# Altium schematic sheet lelay.SchDoc
size A3; Organization: Altium Limited; Address1: L3, 12a Rodborough Rd; Address2: Frenchs Forest; Address3: NSW; Address4: Australia 2086
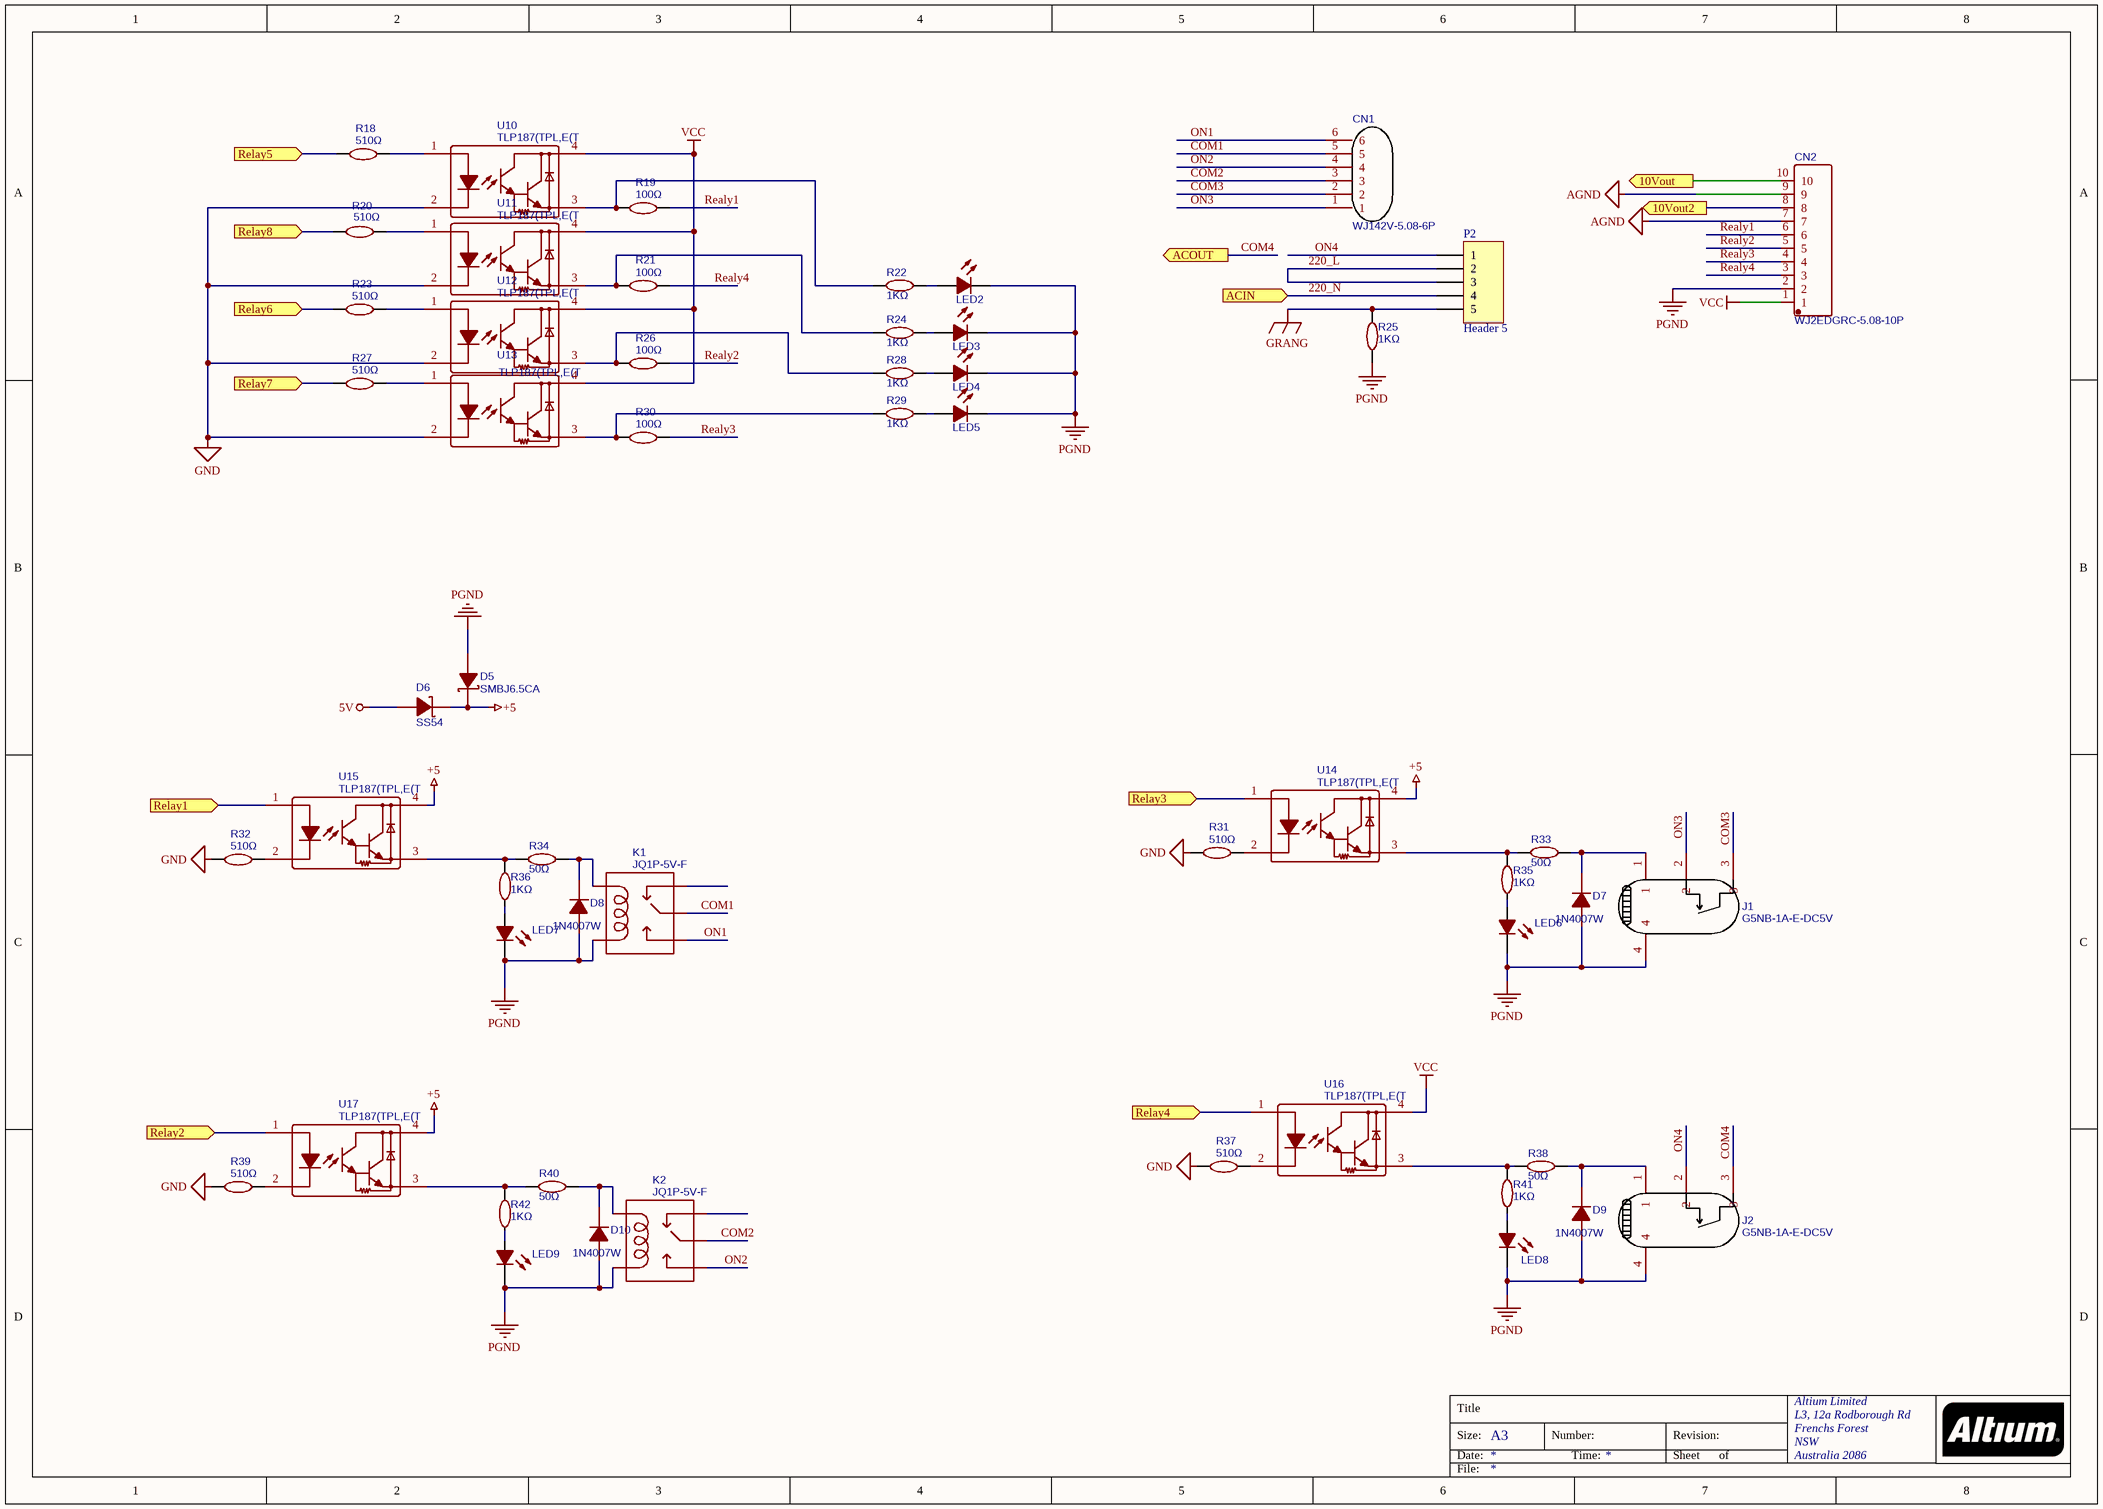
[diagram p0: lelay.SchDoc]

## Parts
CN1  WJ142V-5.08-6P  [5.08_6P]
CN2  WJ2EDGRC-5.08-10P  [WJ2EDGRC-5.08-10P]
D5  SMBJ6.5CA  [SMB(DO-214AA)]
D6  SS54  [SMA(DO-214AC)]
D7  1N4007W  [SOD-123FL]
D8  1N4007W  [SOD-123FL]
D9  1N4007W  [SOD-123FL]
D10  1N4007W  [SOD-123FL]
J1  G5NB-1A-E-DC5V  [G5NB-1A-E-DC5V]
J2  G5NB-1A-E-DC5V  [继电器]
K1  JQ1P-5V-F  [JQ1P-5V-F]
K2  JQ1P-5V-F  [JQ1P-5V-F]
LED2  19-217/GHC-YR1S2/3T  [LED-0603]  (value not drawn)
LED3  19-217/GHC-YR1S2/3T  [LED-0603]  (value not drawn)
LED4  19-217/GHC-YR1S2/3T  [LED-0603]  (value not drawn)
LED5  19-217/GHC-YR1S2/3T  [LED-0603]  (value not drawn)
LED6  19-217/GHC-YR1S2/3T  [LED-0603]  (value not drawn)
LED7  19-217/GHC-YR1S2/3T  [LED-0603]  (value not drawn)
LED8  19-217/GHC-YR1S2/3T  [LED-0603]  (value not drawn)
LED9  19-217/GHC-YR1S2/3T  [LED-0603]  (value not drawn)
P2  Header 5  [5p-7.62]
R18  510Ω  [0603-res]
R19  100Ω  [0603-res]
R20  510Ω  [0603-res]
R21  100Ω  [0603-res]
R22  1KΩ  [0603-res]
R23  510Ω  [0603-res]
R24  1KΩ  [0603-res]
R25  1KΩ  [0603-res]
R26  100Ω  [0603-res]
R27  510Ω  [0603-res]
R28  1KΩ  [0603-res]
R29  1KΩ  [0603-res]
R30  100Ω  [0603-res]
R31  510Ω  [0603-res]
R32  510Ω  [0603-res]
R33  50Ω  [0603-res]
R34  50Ω  [0603-res]
R35  1KΩ  [0603-res]
R36  1KΩ  [0603-res]
R37  510Ω  [0603-res]
R38  50Ω  [0603-res]
R39  510Ω  [0603-res]
R40  50Ω  [0603-res]
R41  1KΩ  [0603-res]
R42  1KΩ  [0603-res]
U10  TLP187(TPL,E(T  [TLP187]
U11  TLP187(TPL,E(T  [TLP187]
U12  TLP187(TPL,E(T  [TLP187]
U13  TLP187(TPL,E(T  [TLP187]
U14  TLP187(TPL,E(T  [TLP187]
U15  TLP187(TPL,E(T  [TLP187]
U16  TLP187(TPL,E(T  [TLP187]
U17  TLP187(TPL,E(T  [TLP187]

## Ports
10Vout2 (out), 10Vout (out), ACIN (in), ACOUT (out), Relay1 (in), Relay2 (in), Relay3 (in), Relay4 (in), Relay5 (in), Relay6 (in), Relay7 (in), Relay8 (in)

## Nets
5V: D6.1(A)
+5: D5.2 D6.2(K) U14.4 U15.4 U17.4
AGND: CN2.7 CN2.9
GND: R31.1 R32.1 R37.1 R39.1 U10.2 U11.2 U12.2 U13.2
GRANG: P2.5 R25.2
PGND: CN2.2 D5.1 D7.2(A) D8.2(A) D9.2(A) D10.2(A) J1.4 J2.4 K1.1 K2.1 LED2.2(C) LED3.2(C) LED4.2(C) LED5.2(C) LED6.2(C) LED7.2(C) LED8.2(C) LED9.2(C) R25.1
VCC: CN2.1 U10.4 U11.4 U12.4 U13.4 U16.4
10Vout: CN2.10 ; port 10Vout
10Vout2: CN2.8 ; port 10Vout2
220_L: P2.2 P2.3
220_N: P2.4 ; port ACIN
COM1: CN1.5 K1.4
COM2: CN1.3 K2.4
COM3: CN1.2 J1.3
COM4: J2.3 ; port ACOUT
ON1: CN1.6 K1.5
ON2: CN1.4 K2.5
ON3: CN1.1 J1.2
ON4: J2.2 P2.1
Realy1: CN2.6 R19.2
Realy2: CN2.5 R26.2
Realy3: CN2.4 R30.2
Realy4: CN2.3 R21.2
Relay1: U15.1 ; port Relay1
Relay2: U17.1 ; port Relay2
Relay3: U14.1 ; port Relay3
Relay4: U16.1 ; port Relay4
Relay5: R18.1 ; port Relay5
Relay6: R23.1 ; port Relay6
Relay7: R27.1 ; port Relay7
Relay8: R20.1 ; port Relay8
NetD7_1: D7.1(K) J1.1 R33.2
NetD8_1: D8.1(K) K1.2 R34.2
NetD9_1: D9.1(K) J2.1 R38.2
NetD10_1: D10.1(K) K2.2 R40.2
NetLED2_1: LED2.1(A) R22.2
NetLED3_1: LED3.1(A) R24.2
NetLED4_1: LED4.1(A) R28.2
NetLED5_1: LED5.1(A) R29.2
NetLED6_1: LED6.1(A) R35.2
NetLED7_1: LED7.1(A) R36.2
NetLED8_1: LED8.1(A) R41.2
NetLED9_1: LED9.1(A) R42.2
NetR18_2: R18.2 U10.1
NetR19_1: R19.1 R22.1 U10.3
NetR20_2: R20.2 U11.1
NetR21_1: R21.1 R24.1 U11.3
NetR23_2: R23.2 U12.1
NetR26_1: R26.1 R28.1 U12.3
NetR27_2: R27.2 U13.1
NetR29_1: R29.1 R30.1 U13.3
NetR31_2: R31.2 U14.2
NetR32_2: R32.2 U15.2
NetR33_1: R33.1 R35.1 U14.3
NetR34_1: R34.1 R36.1 U15.3
NetR37_2: R37.2 U16.2
NetR38_1: R38.1 R41.1 U16.3
NetR39_2: R39.2 U17.2
NetR40_1: R40.1 R42.1 U17.3

Not connected (* = marked no-connect by the designer): K1 3; K2 3

## Notes on the sheet
- Title
- Size:
- Date:
- A3
- Number:
- Time:
- Revision:
- Sheet
- of
- File:

## Library data of the parts
CN1 CN2 = (no symbol name): BOM_Manufacturer: ReliaPro; BOM_Supplier: LCSC; spicePre: C
  CN1: BOM_Manufacturer Part: WJ142V-5.08-6P; BOM_LCSC: C35897; image: //image.lceda.cn/szlcsc/C35897.jpg
  CN2: BOM_Manufacturer Part: WJ2EDGRC-5.08-10P; BOM_LCSC: C28429; image: //image.lceda.cn/szlcsc/C28429.jpg
D5 D6 = (no symbol name): BOM_Manufacturer: MDD; BOM_Supplier: LCSC; spicePre: D
  D5: BOM_Manufacturer Part: SMBJ6.5CA; BOM_LCSC: C113979
  D6: BOM_Manufacturer Part: SS54; BOM_LCSC: C22452; BOM_LCSC Assembly: Yes; image: //image.lceda.cn/szlcsc/C22452.jpg
D7-D10 = (no symbol name): BOM_Manufacturer: Jingdao; BOM_Supplier: LCSC; BOM_Manufacturer Part: 1N4007W; BOM_LCSC: C108803; spicePre: D
J1 J2 = (no symbol name): BOM_Manufacturer: OMRON; BOM_Supplier: LCSC; BOM_Manufacturer Part: G5NB-1A-E-DC5V; BOM_LCSC: C48746; image: //image.lceda.cn/szlcsc/C48746.jpg; spicePre: J
K1 K2 = (no symbol name): BOM_Manufacturer: PANASONIC; BOM_Supplier: LCSC; BOM_Manufacturer Part: JQ1P-5V-F; BOM_LCSC: C58271; spicePre: K
LED2-LED9 = (no symbol name): BOM_Manufacturer: EVERLIGHT; BOM_Supplier: LCSC; BOM_Manufacturer Part: 19-217/GHC-YR1S2/3T; BOM_LCSC: C72043; BOM_LCSC Assembly: Yes; image: //image.lceda.cn/szlcsc/C72043.jpg; spicePre: L
P2 = Header 5: Header, 5-Pin; LatestRevisionDate: 17-Jul-2002; LatestRevisionNote: Re-released for DXP Platform.; Publisher: Altium Limited
R18-R21 R23 R26 R27 R30-R32 R37 R39 = (no symbol name): BOM_Manufacturer: UniOhm; BOM_Manufacturer Part: 0603WAF5100T5E; nameAlias: Value; BOM_Supplier: LCSC; BOM_LCSC: C23193; BOM_LCSC Assembly: Yes; spicePre: R; spiceSymbolName: 0603WAF5100T5E
R22 R24 R25 R28 R29 R33-R36 R38 R40-R42 = (no symbol name): BOM_Manufacturer: UniOhm; BOM_Manufacturer Part: 0603WAF1001T5E; nameAlias: Value; BOM_Supplier: LCSC; BOM_LCSC: C21190; BOM_LCSC Assembly: Yes; spicePre: R; spiceSymbolName: 0603WAF1001T5E
U10-U17 = (no symbol name): BOM_Manufacturer: TOSHIBA; BOM_Supplier: LCSC; BOM_Manufacturer Part: TLP187(TPL,E(T; BOM_LCSC: C50180; spicePre: U